# Altium schematic sheet hex.SchDoc
size 420 x 297 mm; SheetNumber: 2; SheetTotal: 2
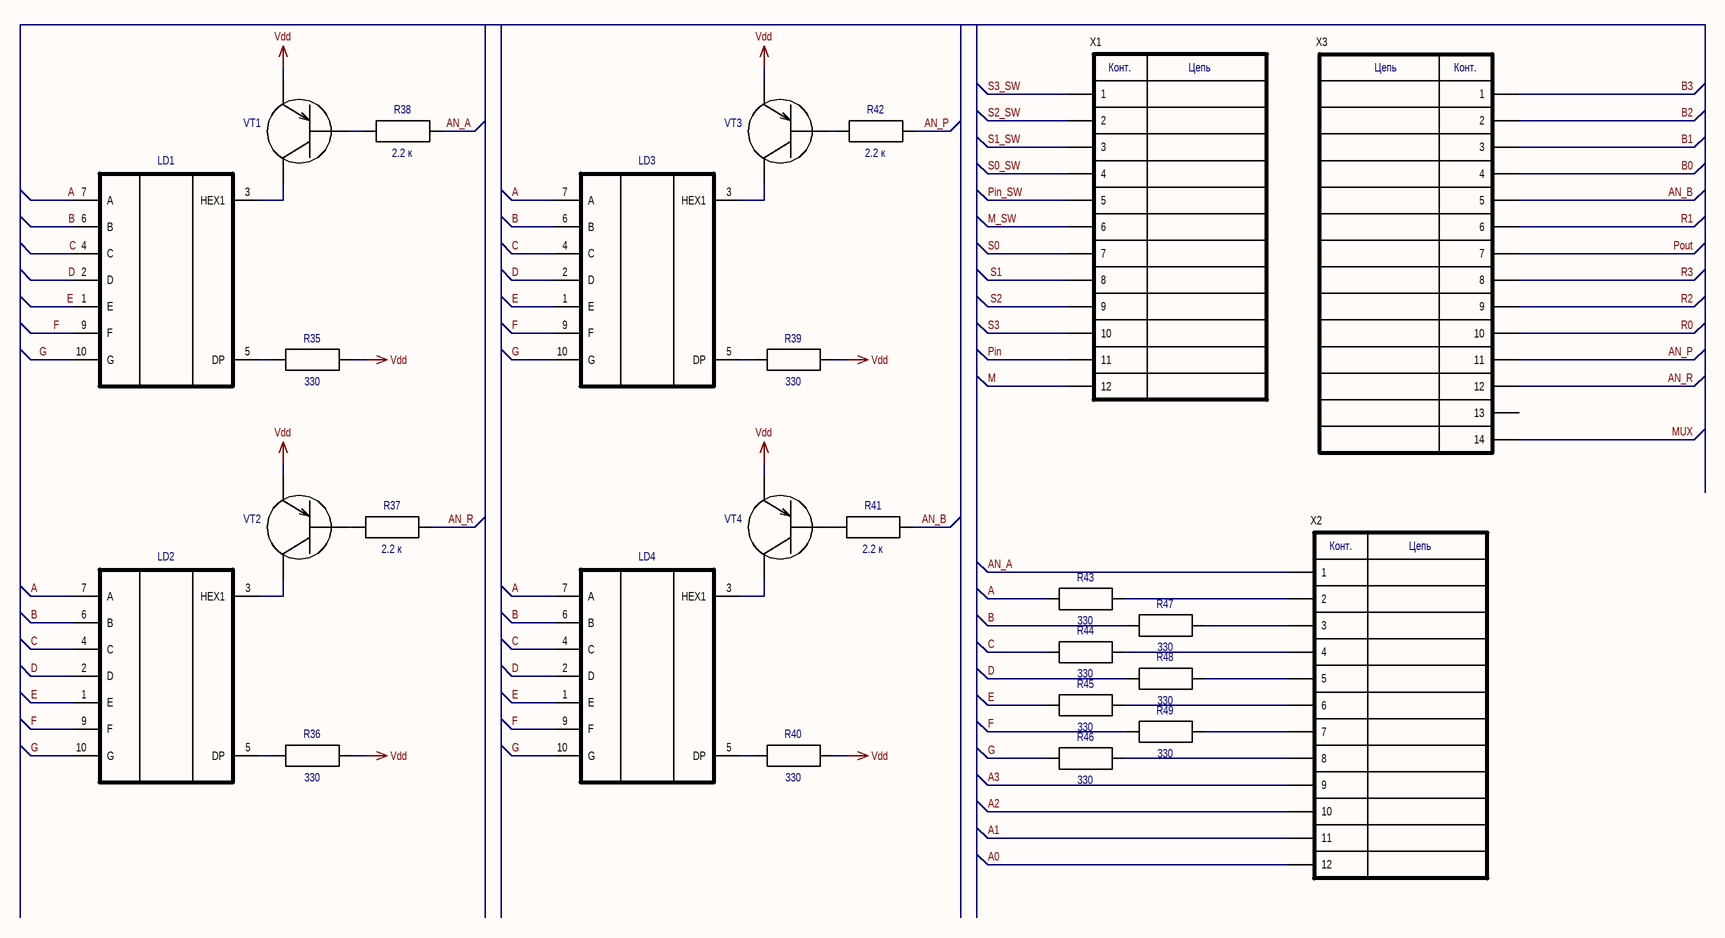
[diagram p0: hex.SchDoc]

## Parts
LD1  4042AS (TSOT-23) Linear Technology  [HEX]  (value not drawn)
LD2  4042AS (TSOT-23) Linear Technology  [HEX]  (value not drawn)
LD3  4042AS (TSOT-23) Linear Technology  [HEX]  (value not drawn)
LD4  4042AS (TSOT-23) Linear Technology  [HEX]  (value not drawn)
R35  value 330  [P1-12-0.1(0603)]
R36  value 330  [P1-12-0.1(0603)]
R37  value 2.2 к  [P1-12-0.1(0603)]
R38  value 2.2 к  [P1-12-0.1(0603)]
R39  value 330  [P1-12-0.1(0603)]
R40  value 330  [P1-12-0.1(0603)]
R41  value 2.2 к  [P1-12-0.1(0603)]
R42  value 2.2 к  [P1-12-0.1(0603)]
R43  value 330  [P1-12-0.1(0603)]
R44  value 330  [P1-12-0.1(0603)]
R45  value 330  [P1-12-0.1(0603)]
R46  value 330  [P1-12-0.1(0603)]
R47  value 330  [P1-12-0.1(0603)]
R48  value 330  [P1-12-0.1(0603)]
R49  value 330  [P1-12-0.1(0603)]
VT1  BC857C (SOT-23) NXP  [SOT23(KT-46)]  (value not drawn)
VT2  BC857C (SOT-23) NXP  [SOT23(KT-46)]  (value not drawn)
VT3  BC857C (SOT-23) NXP  [SOT23(KT-46)]  (value not drawn)
VT4  BC857C (SOT-23) NXP  [SOT23(KT-46)]  (value not drawn)
X1  12pin  [PBD-12]  (value not drawn)
X2  12pin  [PBD-12]  (value not drawn)
X3  14pin  [PBD-14]  (value not drawn)

## Nets
Vdd: R35.2 R36.2 R39.2 R40.2 VT1.2 VT2.2 VT3.2 VT4.2
A: LD1.7(A) LD2.7(A) LD3.7(A) LD4.7(A) R43.1
A0: X2.12
A1: X2.11
A2: X2.10
A3: X2.9
AN_A: R38.2 X2.1
AN_B: R41.2 X3.5
AN_P: R42.2 X3.11
AN_R: R37.2 X3.12
B: LD1.6(B) LD2.6(B) LD3.6(B) LD4.6(B) R47.1
B0: X3.4
B1: X3.3
B2: X3.2
B3: X3.1
C: LD1.4(C) LD2.4(C) LD3.4(C) LD4.4(C) R44.1
D: LD1.2(D) LD2.2(D) LD3.2(D) LD4.2(D) R48.1
E: LD1.1(E) LD2.1(E) LD3.1(E) LD4.1(E) R45.1
F: LD1.9(F) LD2.9(F) LD3.9(F) LD4.9(F) R49.1
G: LD1.10(G) LD2.10(G) LD3.10(G) LD4.10(G) R46.1
M: X1.12
M_SW: X1.6
MUX: X3.14
Pin: X1.11
Pin_SW: X1.5
Pout: X3.7
R0: X3.10
R1: X3.6
R2: X3.9
R3: X3.8
S0: X1.7
S0_SW: X1.4
S1: X1.8
S1_SW: X1.3
S2: X1.9
S2_SW: X1.2
S3: X1.10
S3_SW: X1.1
NetLD1_3: LD1.3(HEX1) VT1.3
NetLD1_5: LD1.5(DP) R35.1
NetLD2_3: LD2.3(HEX1) VT2.3
NetLD2_5: LD2.5(DP) R36.1
NetLD3_3: LD3.3(HEX1) VT3.3
NetLD3_5: LD3.5(DP) R39.1
NetLD4_3: LD4.3(HEX1) VT4.3
NetLD4_5: LD4.5(DP) R40.1
NetR37_1: R37.1 VT2.1
NetR38_1: R38.1 VT1.1
NetR41_1: R41.1 VT4.1
NetR42_1: R42.1 VT3.1
NetR43_2: R43.2 X2.2
NetR44_2: R44.2 X2.4
NetR45_2: R45.2 X2.6
NetR46_2: R46.2 X2.8
NetR47_2: R47.2 X2.3
NetR48_2: R48.2 X2.5
NetR49_2: R49.2 X2.7

Not connected (* = marked no-connect by the designer): X3 13

## Notes on the sheet
- Перв.примен.
- Справ. №
- Подп. и дата
- Инв.№ дубл.
- Взам. инв. №
- Изм.
- Лист
- № докум.
- Подп.
- Дата
- Лит.
- Масса
- Масштаб
- Пров.
- Т.контр
- Разраб.
- Схема электрическая принципиальная
- 1
- Листов
- Инв № подл.
- Н.контр.
- Утв.
- Копировал
- Формат А3
- (in symbol 12pin) Конт.; Цепь
- (in symbol 14pin) Цепь; Конт.

## Library data of the parts
LD1-LD4 = 7-сегментный индикатор_2_1: Company: Linear Technology; PartNumber: 4042AS; Package: TSOT-23
R35-R49 = R: Company: *; PartNumber: *; Package: *; Tolerance: *
VT1-VT4 = VT - Биполярный транзистор PNP: Value: KT3126Б; Package: SOT-23; PartNumber: BC857C; Company: NXP
X1 X2 = 12pin: Manufacturer: *; PartNumber: *
X3 = 14pin: Manufacturer: *; PartNumber: *